# Altium schematic sheet Power.SchDoc
size Letter
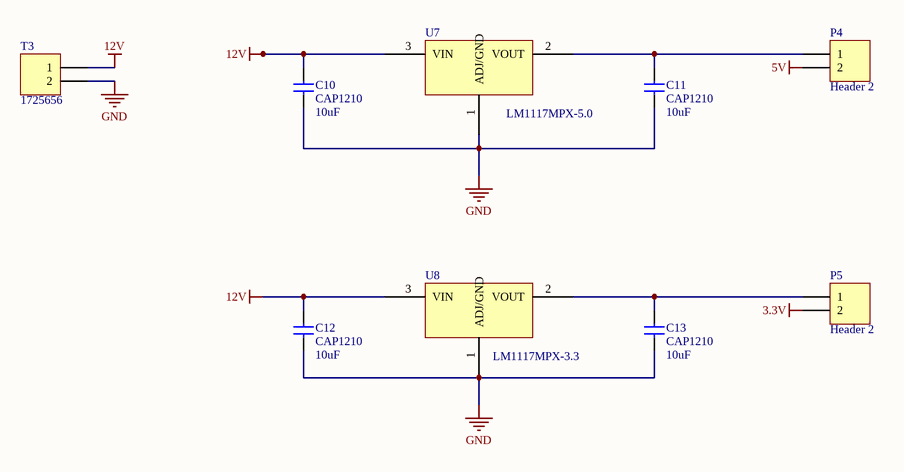
[diagram p0: Power.SchDoc]

## Parts
C10  CAP1210  value 10uF  [CAP1210]
C11  CAP1210  value 10uF  [CAP1210]
C12  CAP1210  value 10uF  [CAP1210]
C13  CAP1210  value 10uF  [CAP1210]
P4  Header 2  [HDR1X2]
P5  Header 2  [HDR1X2]
T3  1725656  [1725656]
U7  LM1117MPX-5.0  [LM1117MPX]
U8  LM1117MPX-3.3  [LM1117MPX]

## Nets
3.3V: P5.2
5V: P4.2
12V: C10.1(A) C12.1(A) T3.1 U7.3(VIN) U8.3(VIN)
GND: C10.2(B) C11.2(B) C12.2(B) C13.2(B) T3.2 U7.1(ADJ/GND) U8.1(ADJ/GND)
NetC11_1: C11.1(A) P4.1 U7.2(VOUT)
NetC13_1: C13.1(A) P5.1 U8.2(VOUT)

## Library data of the parts
C10-C13 = CAP1210: CAP CER 10UF 50V 20% X5R 1210; Supplier 1: Digi-Key; Supplier Part Number 1: 587-2225-1-ND
P4 P5 = Header 2: Header, 2-Pin; LatestRevisionDate: 17-Jul-2002; LatestRevisionNote: Re-released for DXP Platform.; Publisher: Altium Limited
T3 = 1725656: CONN TERM BLOCK 2.54MM 2POS; Supplier 1: Digi-Key; Supplier Part Number 1: 277-1273-ND
U7 = LM1117MPX-5: IC REG LDO 5V 0.8A SOT223; Supplier 1: Digi-Key; Supplier Part Number 1: LM1117MPX-5.0/NOPBCT-ND
U8 = LM1117MPX-3.3: IC REG LDO 3.3V 0.8A SOT223; Supplier 1: Digi-Key; Supplier Part Number 1: LM1117MPX-3.3/NOPBCT-ND